# Altium schematic sheet Sheet1.SchDoc
size A4; SheetNumber: 1; SheetTotal: 1
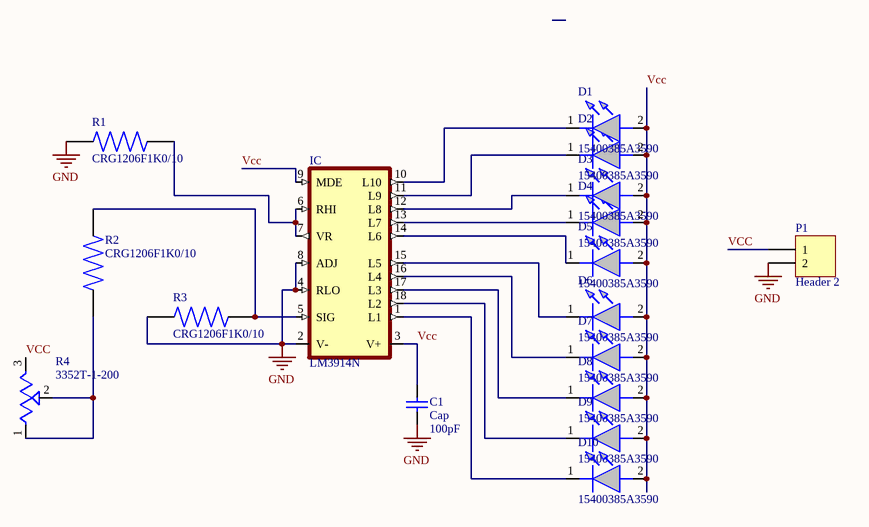
[diagram p0: Sheet1.SchDoc]

## Parts
C1  Cap  value 100pF  [RAD-0.3]
D1  15400385A3590  [15400385A3590]
D2  15400385A3590  [15400385A3590]
D3  15400385A3590  [15400385A3590]
D4  15400385A3590  [15400385A3590]
D5  15400385A3590  [15400385A3590]
D6  15400385A3590  [15400385A3590]
D7  15400385A3590  [15400385A3590]
D8  15400385A3590  [15400385A3590]
D9  15400385A3590  [15400385A3590]
D10  15400385A3590  [15400385A3590]
IC  LM3914N  [DIL18]
P1  Header 2  [HDR1X2]
R1  CRG1206F1K0/10  [RESC3115X65N]
R2  CRG1206F1K0/10  [RESC3115X65N]
R3  CRG1206F1K0/10  [RESC3115X65N]
R4  3352T-1-200  [TRIM_3352T-1-200]

## Nets
GND: C1.1 IC.2(V-) IC.4(RLO) IC.8(ADJ) P1.2 R1.1 R3.1
Vcc: C1.2 D1.2(A) D2.2(A) D3.2(A) D4.2(A) D5.2(A) D6.2(A) D7.2(A) D8.2(A) D9.2(A) D10.2(A) IC.3(V+) IC.9(MDE) P1.1 R4.3(CW)
NetD1_1: D1.1(K) IC.10(L10)
NetD2_1: D2.1(K) IC.11(L9)
NetD3_1: D3.1(K) IC.12(L8)
NetD4_1: D4.1(K) IC.13(L7)
NetD5_1: D5.1(K) IC.14(L6)
NetD6_1: D6.1(K) IC.15(L5)
NetD7_1: D7.1(K) IC.16(L4)
NetD8_1: D8.1(K) IC.17(L3)
NetD9_1: D9.1(K) IC.18(L2)
NetD10_1: D10.1(K) IC.1(L1)
NetIC_5: IC.5(SIG) R2.2 R3.2
NetIC_6: IC.6(RHI) IC.7(VR) R1.2
NetR2_1: R2.1 R4.1(CCW) R4.2(WIPER)

## Library data of the parts
C1 = Cap: Capacitor; Published: 8-Jun-2000; LatestRevisionDate: 17-Jul-2002; LatestRevisionNote: Re-released for DXP Platform.; PackageReference: RAD-0.3; Publisher: Altium Limited; PackageDescription: Radial Cap, Thru-Hole; 2 Leads; 0.3 in Pin Spacing
D1-D10 = 15400385A3590: WURTH ELEKTRONIK - 15400385A3590 - Infrared Emitter, 850 nm, 35 , T-1 (3mm), 60 mW/Sr; Geometry.Height: 10.9mm; Manufacturer_Name: Wurth Elektronik; Manufacturer_Part_Number: 15400385A3590; Mouser Part Number: 710-15400385A3590; Mouser Price/Stock: https://www.mouser.co.uk/ProductDetail/Wurth-Elektronik/15400385A3590?qs=5aG0NVq1C4yszs1ddn0oOg%3D%3D; Arrow Part Number: *; Arrow Price/Stock: *; Mouser Testing Part Number: *; Mouser Testing Price/Stock: *; Datasheet Link: https://www.we-online.com/katalog/datasheet/15400385A3590.pdf
IC = LM3914N: LED Lighting Drivers; MF: Texas Instruments; MP: LM3914N; Package: None; Price: None; Availability: Unavailable; Value: *; SnapEDA_Link: https://www.snapeda.com/parts/LM3914N/Texas%20Instruments/view-part/4652973/?ref=snap
P1 = Header 2: Header, 2-Pin; LatestRevisionDate: 17-Jul-2002; LatestRevisionNote: Re-released for DXP Platform.; Publisher: Altium Limited
R1-R3 = CRG1206F1K0/10: Res KalÄ±n Film 1206 1K Ohm 1% 1 / 4W Â± 100ppm / Â° C KalÄ±plÄ± SMD SMD; Voltage_Rating: 200 V; Power_Rating: .25 W; MF: TE Connectivity; Tolerance: 1%; SnapEDA_Link: https://www.snapeda.com/parts/CRG1206F1K0/10/TE%20Connectivity%20Passive%20Product/view-part/981079/?ref=snap; Price: None; Purchase-URL: https://pricing.snapeda.com/search/part/CRG1206F1K0/10/?ref=eda; Resistance: 1K; EU_RoHS_Compliance: Compliant with Exemptions; MP: CRG1206F1K0/10; Value: *; Availability: Warning; Package: 1206
R4 = 3352T-1-200: 20 Ohms 0.5W, 1/2W Through Hole Thumbwheel Potentiometer Top Adjustment; MF: Bourns; Price: None; Purchase-URL: https://pricing.snapeda.com/search/part/3352T-1-200/?ref=eda; Package: 3352T-3 Bourns; Check_prices: https://www.snapeda.com/parts/3352T-1-200/Bourns/view-part/?ref=eda; Availability: In Stock; MP: 3352T-1-200; Value: *; SnapEDA_Link: https://www.snapeda.com/parts/3352T-1-200/Bourns/view-part/?ref=snap